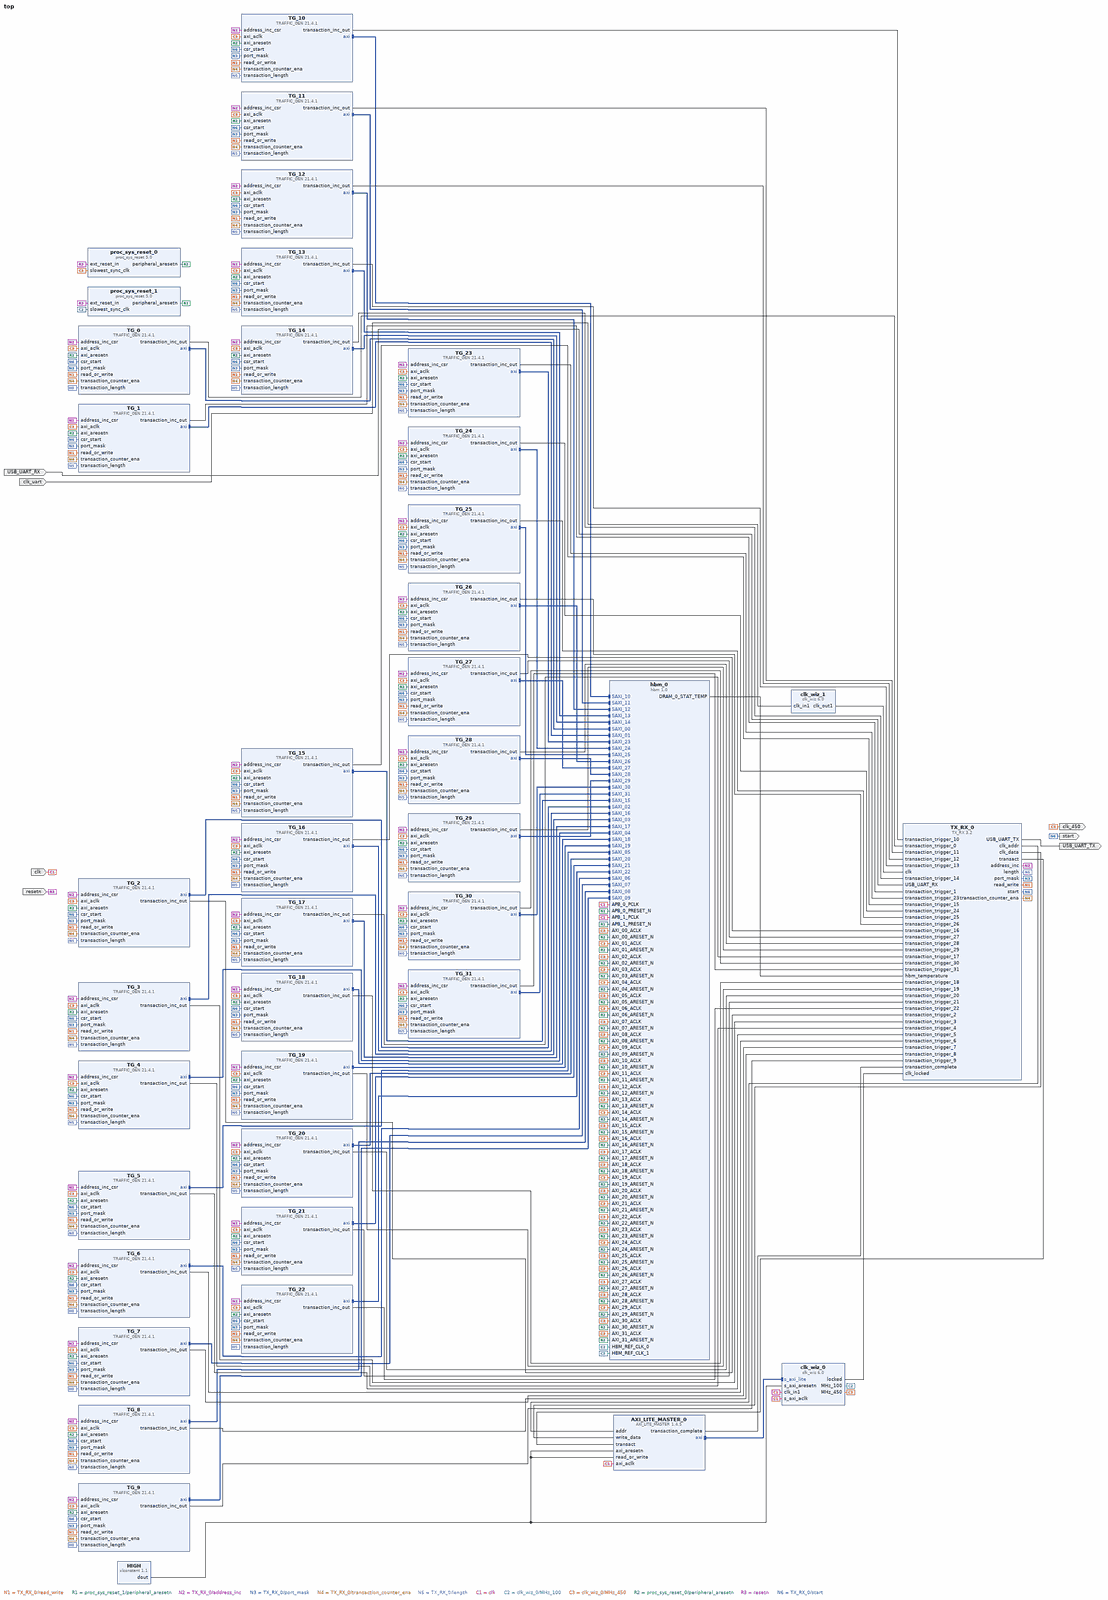
[diagram p0: block diagram of the top level, whole]
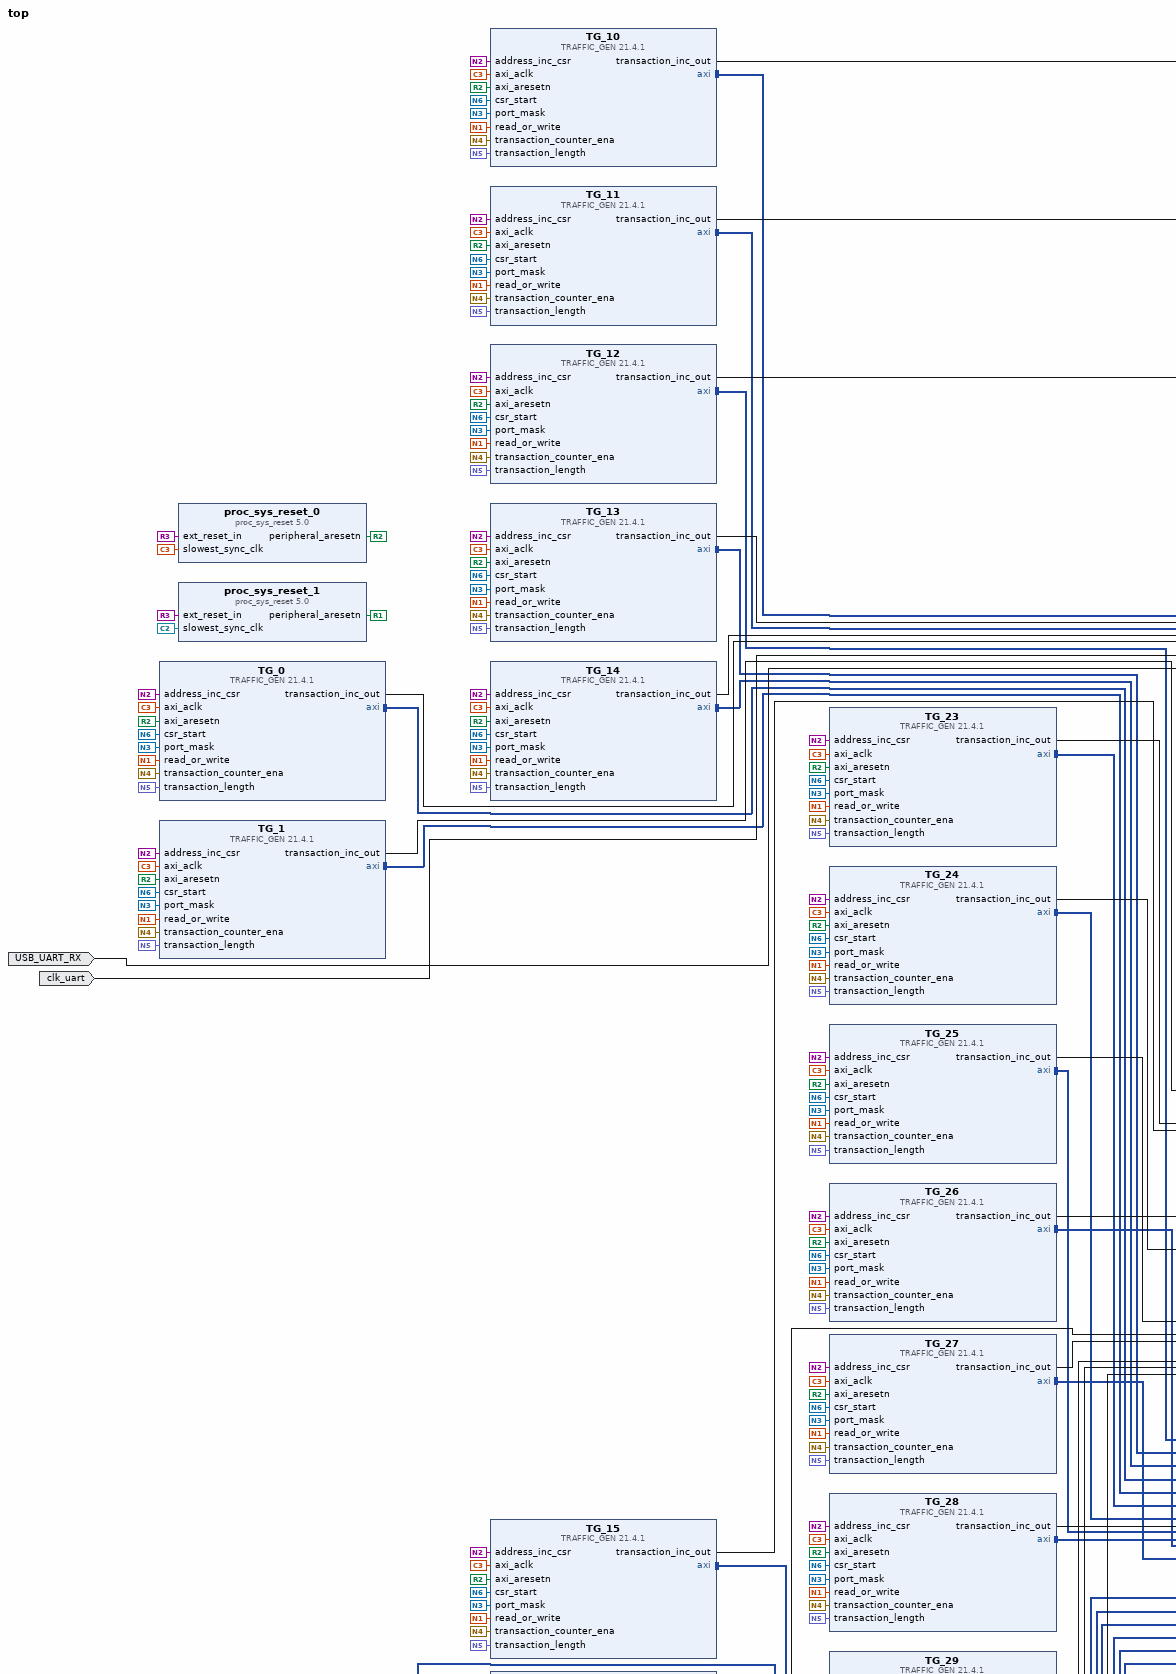
[diagram p1: block diagram of the top level, upper left part]
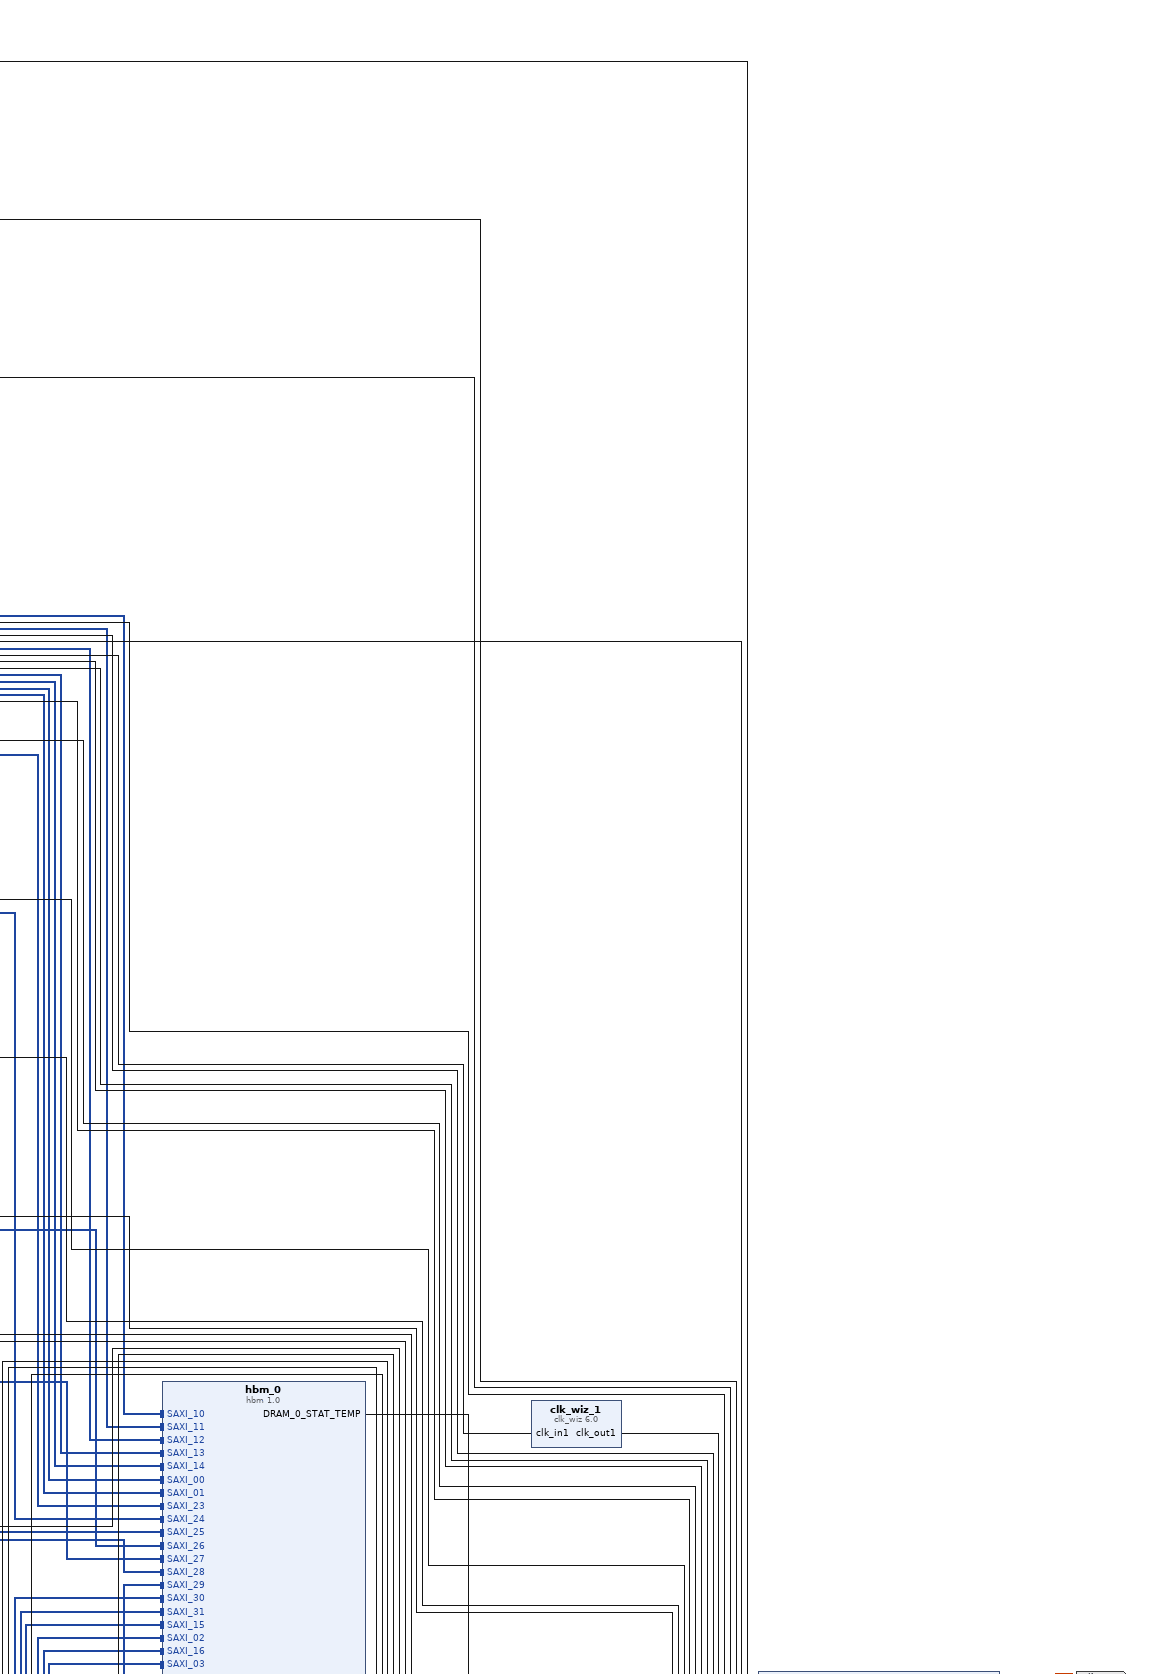
[diagram p2: block diagram of the top level, upper right part]
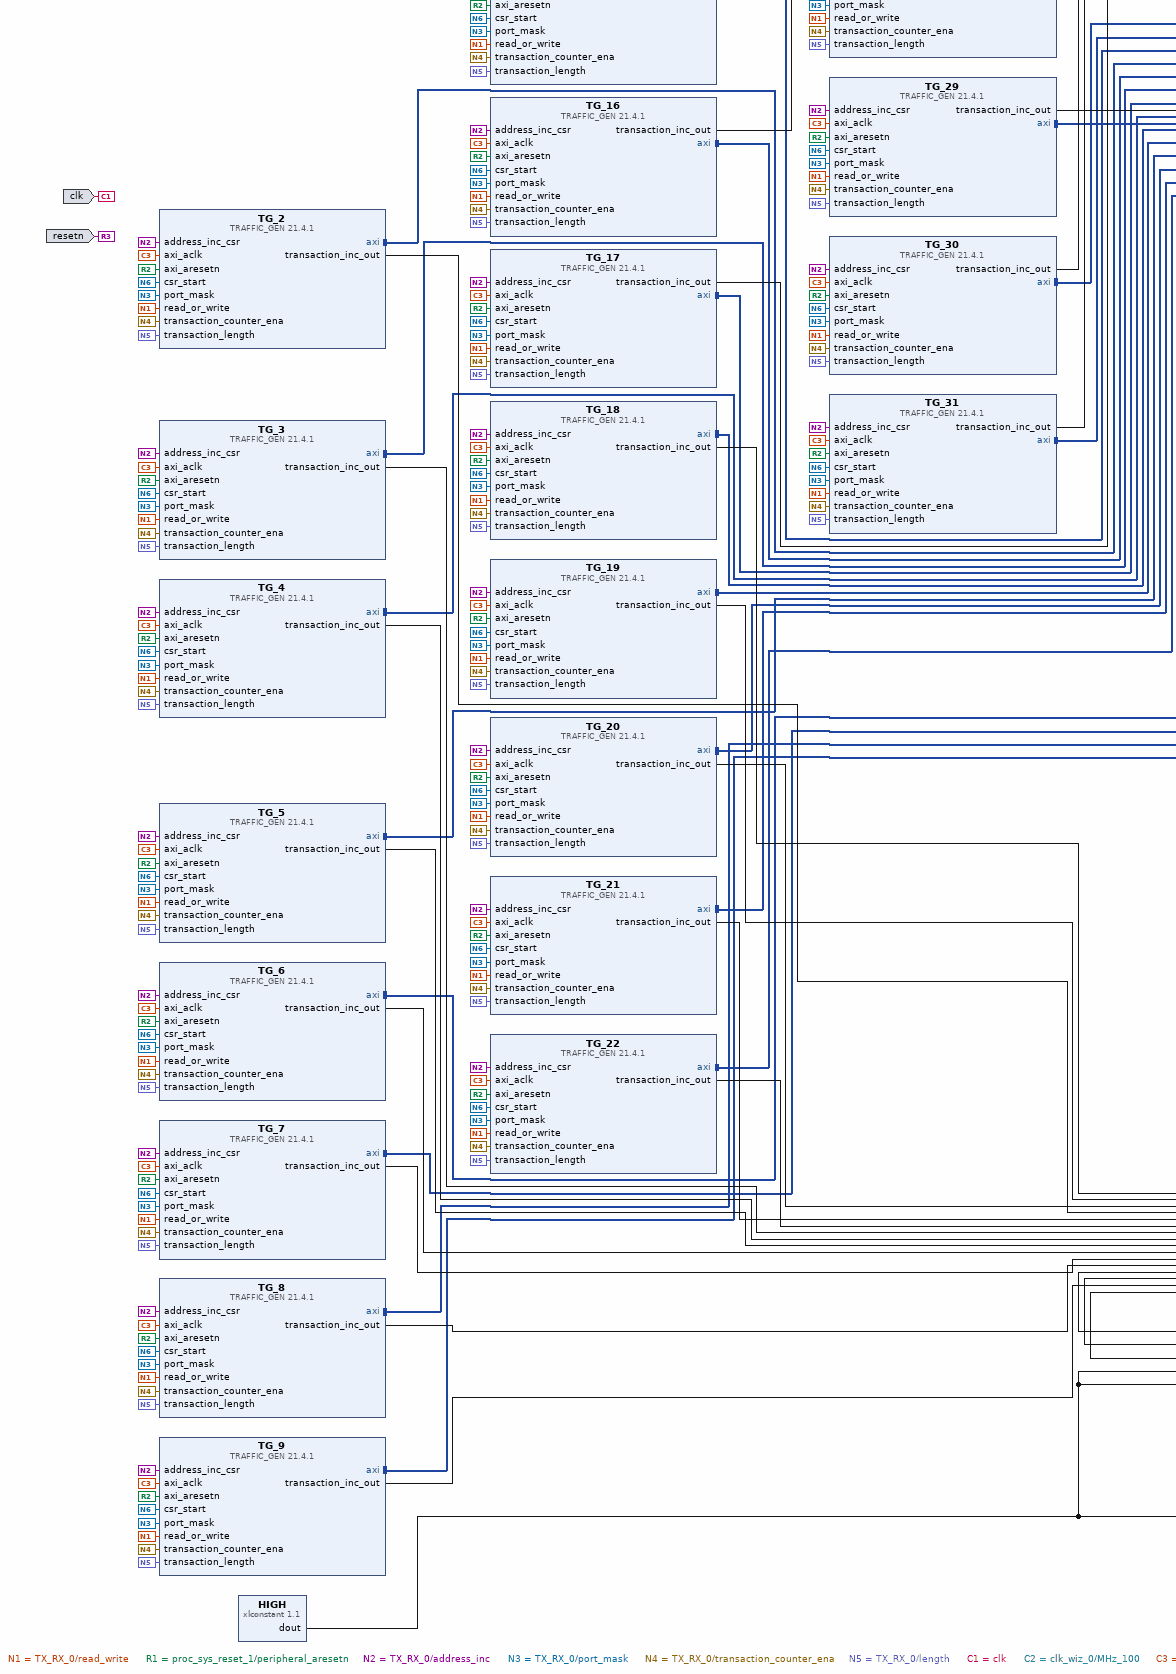
[diagram p3: block diagram of the top level, lower left part]
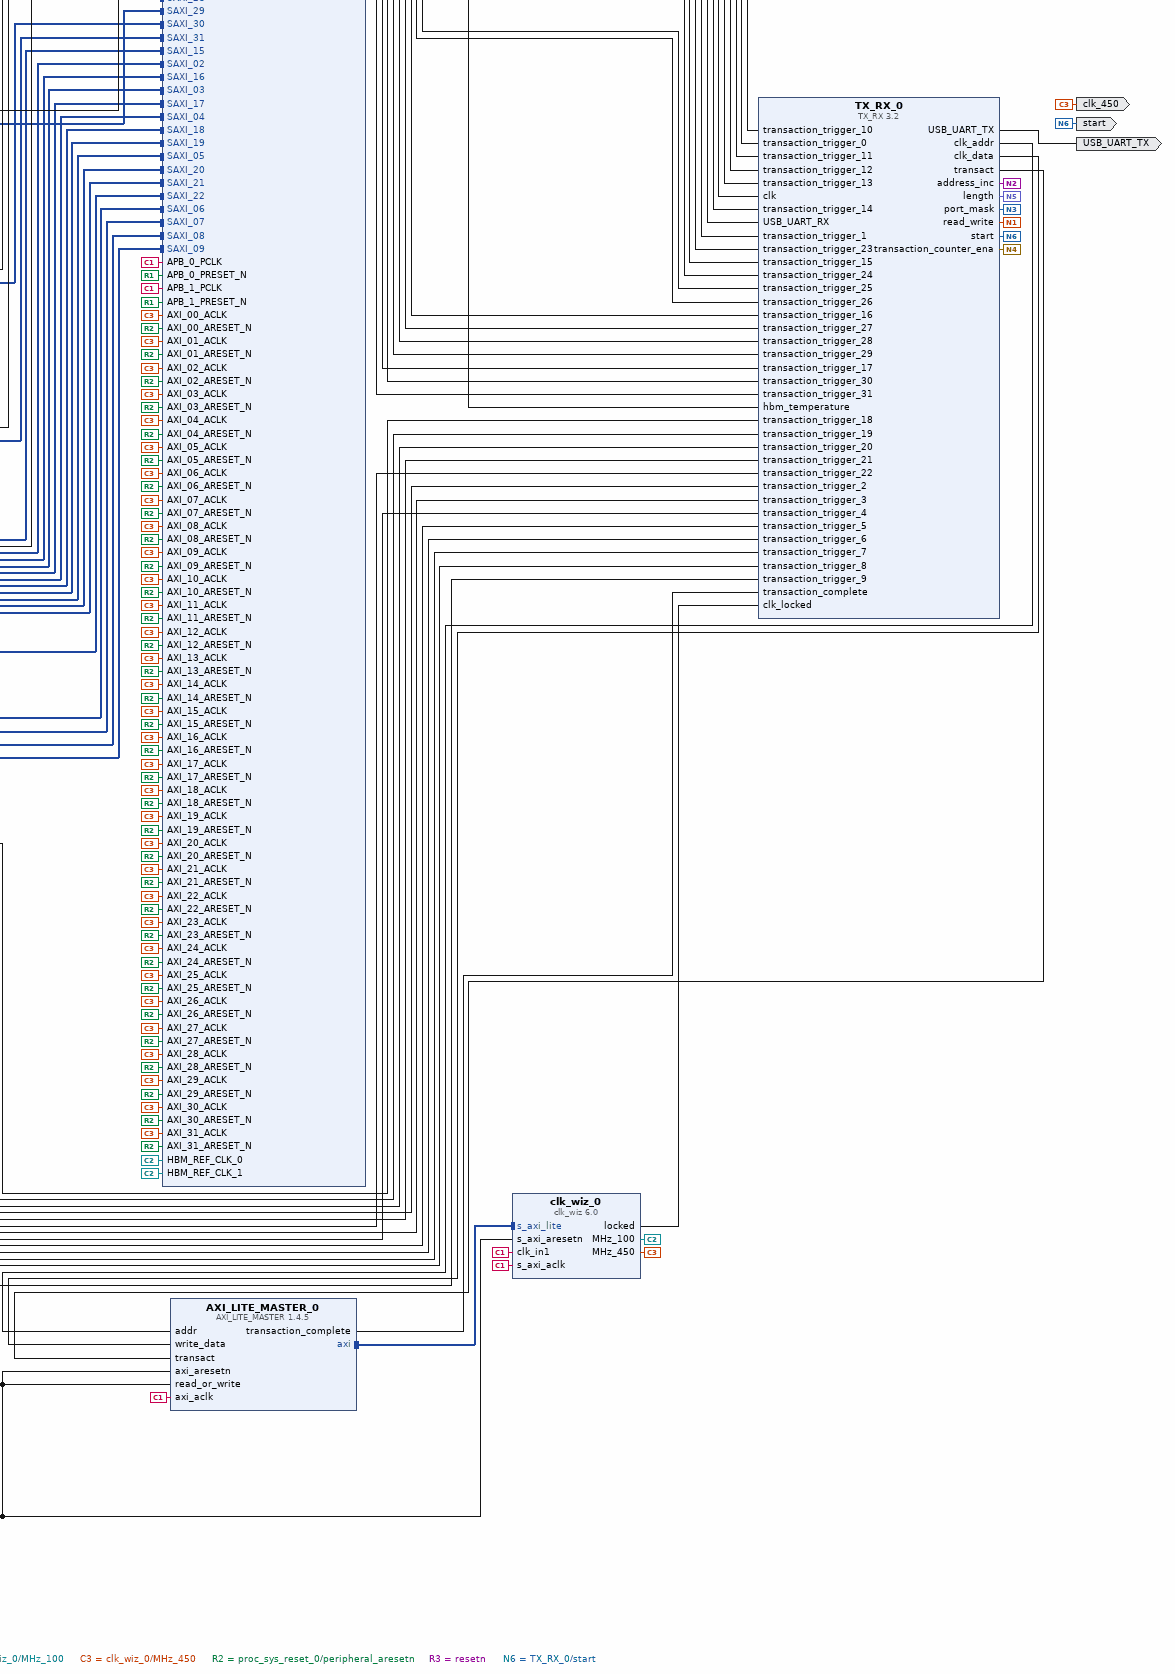
[diagram p4: block diagram of the top level, lower right part]
# Vivado block design top, xcu280-fsvh2892-2L-e, Vivado 2022.2
create_bd_design top

create_bd_port -dir I -type clk clk
set_property -dict {CONFIG.CLK_DOMAIN clk} [get_bd_ports clk]
create_bd_port -dir I -type rst resetn
set_property -dict {CONFIG.POLARITY ACTIVE_HIGH} [get_bd_ports resetn]
create_bd_port -dir I clk_uart
create_bd_port -dir O clk_450
create_bd_port -dir I USB_UART_RX
create_bd_port -dir O USB_UART_TX
create_bd_port -dir O start

create_bd_cell -type ip -vlnv xilinx.com:ip:hbm:1.0 hbm_0
set_property -dict [list \
  CONFIG.USER_APB_EN false \
  CONFIG.USER_APB_PCLK_0 100 \
  CONFIG.USER_APB_PCLK_1 100 \
  CONFIG.USER_AUTO_POPULATE yes \
  CONFIG.USER_DEBUG_EN FALSE \
  CONFIG.USER_HBM_DENSITY 8GB \
  CONFIG.USER_MC0_BG_INTERLEAVE_EN true \
  CONFIG.USER_MC0_CLOSE_PAGE_REORDER false \
  CONFIG.USER_MC0_EN_SBREF false \
  CONFIG.USER_MC0_LOOKAHEAD_ACT true \
  CONFIG.USER_MC0_LOOKAHEAD_PCH true \
  CONFIG.USER_MC0_MAINTAIN_COHERENCY true \
  CONFIG.USER_MC0_MANUAL_ADDR_MAP_SEL false \
  CONFIG.USER_MC0_POP_EN true \
  CONFIG.USER_MC0_REF_TEMP_COMP false \
  CONFIG.USER_MC0_REORDER_EN true \
  CONFIG.USER_MC0_TEMP_CTRL_SELF_REF_INTVL true \
  CONFIG.USER_MC0_TRAFFIC_OPTION User_Defined \
  CONFIG.USER_SWITCH_ENABLE_00 TRUE \
  CONFIG.USER_SWITCH_ENABLE_01 TRUE \
  CONFIG.USER_XSDB_INTF_EN TRUE \
] [get_bd_cells hbm_0]
create_bd_cell -type ip -vlnv xilinx.com:ip:clk_wiz:6.0 clk_wiz_0
set_property -dict [list \
  CONFIG.AXI_DRP true \
  CONFIG.CLKOUT1_DRIVES Buffer \
  CONFIG.CLKOUT1_JITTER 103.830 \
  CONFIG.CLKOUT1_PHASE_ERROR 105.461 \
  CONFIG.CLKOUT1_REQUESTED_OUT_FREQ 450 \
  CONFIG.CLKOUT2_DRIVES Buffer \
  CONFIG.CLKOUT2_JITTER 137.681 \
  CONFIG.CLKOUT2_PHASE_ERROR 105.461 \
  CONFIG.CLKOUT2_REQUESTED_OUT_FREQ 100 \
  CONFIG.CLKOUT2_USED true \
  CONFIG.CLKOUT3_DRIVES Buffer \
  CONFIG.CLKOUT3_JITTER 159.475 \
  CONFIG.CLKOUT3_PHASE_ERROR 105.461 \
  CONFIG.CLKOUT3_REQUESTED_OUT_FREQ 66.66667 \
  CONFIG.CLKOUT3_USED false \
  CONFIG.CLKOUT4_DRIVES Buffer \
  CONFIG.CLKOUT5_DRIVES Buffer \
  CONFIG.CLKOUT6_DRIVES Buffer \
  CONFIG.CLKOUT7_DRIVES Buffer \
  CONFIG.CLK_OUT1_PORT MHz_450 \
  CONFIG.CLK_OUT2_PORT MHz_100 \
  CONFIG.CLK_OUT3_PORT APB \
  CONFIG.ENABLE_CLOCK_MONITOR false \
  CONFIG.FEEDBACK_SOURCE FDBK_AUTO \
  CONFIG.INTERFACE_SELECTION Enable_AXI \
  CONFIG.MMCM_BANDWIDTH OPTIMIZED \
  CONFIG.MMCM_CLKFBOUT_MULT_F 9.000 \
  CONFIG.MMCM_CLKIN1_PERIOD 10.000 \
  CONFIG.MMCM_CLKIN2_PERIOD 10.000 \
  CONFIG.MMCM_CLKOUT0_DIVIDE_F 2.000 \
  CONFIG.MMCM_CLKOUT1_DIVIDE 9 \
  CONFIG.MMCM_CLKOUT2_DIVIDE 1 \
  CONFIG.MMCM_COMPENSATION AUTO \
  CONFIG.MMCM_DIVCLK_DIVIDE 1 \
  CONFIG.NUM_OUT_CLKS 2 \
  CONFIG.OPTIMIZE_CLOCKING_STRUCTURE_EN false \
  CONFIG.PHASE_DUTY_CONFIG false \
  CONFIG.PRIMITIVE MMCM \
  CONFIG.RESET_BOARD_INTERFACE resetn \
  CONFIG.RESET_PORT reset \
  CONFIG.RESET_TYPE ACTIVE_HIGH \
  CONFIG.USE_BOARD_FLOW true \
  CONFIG.USE_DYN_RECONFIG true \
  CONFIG.USE_LOCKED true \
  CONFIG.USE_RESET true \
] [get_bd_cells clk_wiz_0]
create_bd_cell -type ip -vlnv xilinx.com:ip:proc_sys_reset:5.0 proc_sys_reset_0
set_property -dict {CONFIG.RESET_BOARD_INTERFACE resetn CONFIG.USE_BOARD_FLOW true} [get_bd_cells proc_sys_reset_0]
create_bd_cell -type ip -vlnv xilinx.com:ip:proc_sys_reset:5.0 proc_sys_reset_1
set_property -dict {CONFIG.RESET_BOARD_INTERFACE resetn CONFIG.USE_BOARD_FLOW true} [get_bd_cells proc_sys_reset_1]
create_bd_cell -type ip -vlnv user.org:user:TRAFFIC_GEN:21.4.1 TG_0
create_bd_cell -type ip -vlnv user.org:user:TRAFFIC_GEN:21.4.1 TG_10
set_property -dict {CONFIG.traffic_gen_num 10} [get_bd_cells TG_10]
create_bd_cell -type ip -vlnv user.org:user:TRAFFIC_GEN:21.4.1 TG_11
set_property -dict {CONFIG.traffic_gen_num 11} [get_bd_cells TG_11]
create_bd_cell -type ip -vlnv user.org:user:TRAFFIC_GEN:21.4.1 TG_12
set_property -dict {CONFIG.traffic_gen_num 12} [get_bd_cells TG_12]
create_bd_cell -type ip -vlnv user.org:user:TRAFFIC_GEN:21.4.1 TG_13
set_property -dict {CONFIG.traffic_gen_num 13} [get_bd_cells TG_13]
create_bd_cell -type ip -vlnv user.org:user:TRAFFIC_GEN:21.4.1 TG_14
set_property -dict {CONFIG.traffic_gen_num 14} [get_bd_cells TG_14]
create_bd_cell -type ip -vlnv user.org:user:TRAFFIC_GEN:21.4.1 TG_15
set_property -dict {CONFIG.traffic_gen_num 15} [get_bd_cells TG_15]
create_bd_cell -type ip -vlnv user.org:user:TRAFFIC_GEN:21.4.1 TG_16
set_property -dict {CONFIG.traffic_gen_num 16} [get_bd_cells TG_16]
create_bd_cell -type ip -vlnv user.org:user:TRAFFIC_GEN:21.4.1 TG_17
set_property -dict {CONFIG.traffic_gen_num 17} [get_bd_cells TG_17]
create_bd_cell -type ip -vlnv user.org:user:TRAFFIC_GEN:21.4.1 TG_18
set_property -dict {CONFIG.traffic_gen_num 18} [get_bd_cells TG_18]
create_bd_cell -type ip -vlnv user.org:user:TRAFFIC_GEN:21.4.1 TG_19
set_property -dict {CONFIG.traffic_gen_num 19} [get_bd_cells TG_19]
create_bd_cell -type ip -vlnv user.org:user:TRAFFIC_GEN:21.4.1 TG_1
set_property -dict {CONFIG.traffic_gen_num 1} [get_bd_cells TG_1]
create_bd_cell -type ip -vlnv user.org:user:TRAFFIC_GEN:21.4.1 TG_20
set_property -dict {CONFIG.traffic_gen_num 20} [get_bd_cells TG_20]
create_bd_cell -type ip -vlnv user.org:user:TRAFFIC_GEN:21.4.1 TG_21
set_property -dict {CONFIG.traffic_gen_num 21} [get_bd_cells TG_21]
create_bd_cell -type ip -vlnv user.org:user:TRAFFIC_GEN:21.4.1 TG_22
set_property -dict {CONFIG.traffic_gen_num 22} [get_bd_cells TG_22]
create_bd_cell -type ip -vlnv user.org:user:TRAFFIC_GEN:21.4.1 TG_23
set_property -dict {CONFIG.traffic_gen_num 23} [get_bd_cells TG_23]
create_bd_cell -type ip -vlnv user.org:user:TRAFFIC_GEN:21.4.1 TG_24
set_property -dict {CONFIG.traffic_gen_num 24} [get_bd_cells TG_24]
create_bd_cell -type ip -vlnv user.org:user:TRAFFIC_GEN:21.4.1 TG_25
set_property -dict {CONFIG.traffic_gen_num 25} [get_bd_cells TG_25]
create_bd_cell -type ip -vlnv user.org:user:TRAFFIC_GEN:21.4.1 TG_26
set_property -dict {CONFIG.traffic_gen_num 26} [get_bd_cells TG_26]
create_bd_cell -type ip -vlnv user.org:user:TRAFFIC_GEN:21.4.1 TG_27
set_property -dict {CONFIG.traffic_gen_num 27} [get_bd_cells TG_27]
create_bd_cell -type ip -vlnv user.org:user:TRAFFIC_GEN:21.4.1 TG_28
set_property -dict {CONFIG.traffic_gen_num 28} [get_bd_cells TG_28]
create_bd_cell -type ip -vlnv user.org:user:TRAFFIC_GEN:21.4.1 TG_29
set_property -dict {CONFIG.traffic_gen_num 29} [get_bd_cells TG_29]
create_bd_cell -type ip -vlnv user.org:user:TRAFFIC_GEN:21.4.1 TG_2
set_property -dict {CONFIG.traffic_gen_num 2} [get_bd_cells TG_2]
create_bd_cell -type ip -vlnv user.org:user:TRAFFIC_GEN:21.4.1 TG_30
set_property -dict {CONFIG.traffic_gen_num 30} [get_bd_cells TG_30]
create_bd_cell -type ip -vlnv user.org:user:TRAFFIC_GEN:21.4.1 TG_31
set_property -dict {CONFIG.traffic_gen_num 31} [get_bd_cells TG_31]
create_bd_cell -type ip -vlnv user.org:user:TRAFFIC_GEN:21.4.1 TG_3
set_property -dict {CONFIG.traffic_gen_num 3} [get_bd_cells TG_3]
create_bd_cell -type ip -vlnv user.org:user:TRAFFIC_GEN:21.4.1 TG_4
set_property -dict {CONFIG.traffic_gen_num 4} [get_bd_cells TG_4]
create_bd_cell -type ip -vlnv user.org:user:TRAFFIC_GEN:21.4.1 TG_5
set_property -dict {CONFIG.traffic_gen_num 5} [get_bd_cells TG_5]
create_bd_cell -type ip -vlnv user.org:user:TRAFFIC_GEN:21.4.1 TG_6
set_property -dict {CONFIG.traffic_gen_num 6} [get_bd_cells TG_6]
create_bd_cell -type ip -vlnv user.org:user:TRAFFIC_GEN:21.4.1 TG_7
set_property -dict {CONFIG.traffic_gen_num 7} [get_bd_cells TG_7]
create_bd_cell -type ip -vlnv user.org:user:TRAFFIC_GEN:21.4.1 TG_8
set_property -dict {CONFIG.traffic_gen_num 8} [get_bd_cells TG_8]
create_bd_cell -type ip -vlnv user.org:user:TRAFFIC_GEN:21.4.1 TG_9
set_property -dict {CONFIG.traffic_gen_num 9} [get_bd_cells TG_9]
create_bd_cell -type ip -vlnv xilinx.com:ip:xlconstant:1.1 HIGH
create_bd_cell -type ip -vlnv user.org:user:AXI_LITE_MASTER:1.4.5 AXI_LITE_MASTER_0
create_bd_cell -type ip -vlnv xilinx.com:ip:clk_wiz:6.0 clk_wiz_1
set_property -dict {CONFIG.USE_LOCKED false CONFIG.USE_RESET false} [get_bd_cells clk_wiz_1]
create_bd_cell -type ip -vlnv user.org:user:TX_RX:3.2 TX_RX_0

# ---- connections ----

connect_bd_intf_net [get_bd_intf_pins AXI_LITE_MASTER_0/axi] [get_bd_intf_pins clk_wiz_0/s_axi_lite]
connect_bd_intf_net -intf_net BIST_0_axi [get_bd_intf_pins TG_0/axi] [get_bd_intf_pins hbm_0/SAXI_00]
connect_bd_intf_net -intf_net BIST_10_axi [get_bd_intf_pins TG_10/axi] [get_bd_intf_pins hbm_0/SAXI_10]
connect_bd_intf_net -intf_net BIST_11_axi [get_bd_intf_pins TG_11/axi] [get_bd_intf_pins hbm_0/SAXI_11]
connect_bd_intf_net -intf_net BIST_12_axi [get_bd_intf_pins TG_12/axi] [get_bd_intf_pins hbm_0/SAXI_12]
connect_bd_intf_net -intf_net BIST_13_axi [get_bd_intf_pins TG_13/axi] [get_bd_intf_pins hbm_0/SAXI_13]
connect_bd_intf_net -intf_net BIST_14_axi [get_bd_intf_pins TG_14/axi] [get_bd_intf_pins hbm_0/SAXI_14]
connect_bd_intf_net -intf_net BIST_15_axi [get_bd_intf_pins TG_15/axi] [get_bd_intf_pins hbm_0/SAXI_15]
connect_bd_intf_net -intf_net BIST_16_axi [get_bd_intf_pins hbm_0/SAXI_16] [get_bd_intf_pins TG_16/axi]
connect_bd_intf_net -intf_net BIST_17_axi [get_bd_intf_pins hbm_0/SAXI_17] [get_bd_intf_pins TG_17/axi]
connect_bd_intf_net -intf_net BIST_18_axi [get_bd_intf_pins hbm_0/SAXI_18] [get_bd_intf_pins TG_18/axi]
connect_bd_intf_net -intf_net BIST_19_axi [get_bd_intf_pins hbm_0/SAXI_19] [get_bd_intf_pins TG_19/axi]
connect_bd_intf_net -intf_net BIST_1_axi [get_bd_intf_pins TG_1/axi] [get_bd_intf_pins hbm_0/SAXI_01]
connect_bd_intf_net -intf_net BIST_20_axi [get_bd_intf_pins hbm_0/SAXI_20] [get_bd_intf_pins TG_20/axi]
connect_bd_intf_net -intf_net BIST_21_axi [get_bd_intf_pins hbm_0/SAXI_21] [get_bd_intf_pins TG_21/axi]
connect_bd_intf_net -intf_net BIST_22_axi [get_bd_intf_pins hbm_0/SAXI_22] [get_bd_intf_pins TG_22/axi]
connect_bd_intf_net -intf_net BIST_23_axi [get_bd_intf_pins hbm_0/SAXI_23] [get_bd_intf_pins TG_23/axi]
connect_bd_intf_net -intf_net BIST_24_axi [get_bd_intf_pins hbm_0/SAXI_24] [get_bd_intf_pins TG_24/axi]
connect_bd_intf_net -intf_net BIST_25_axi [get_bd_intf_pins hbm_0/SAXI_25] [get_bd_intf_pins TG_25/axi]
connect_bd_intf_net -intf_net BIST_26_axi [get_bd_intf_pins hbm_0/SAXI_26] [get_bd_intf_pins TG_26/axi]
connect_bd_intf_net -intf_net BIST_27_axi [get_bd_intf_pins hbm_0/SAXI_27] [get_bd_intf_pins TG_27/axi]
connect_bd_intf_net -intf_net BIST_28_axi [get_bd_intf_pins hbm_0/SAXI_28] [get_bd_intf_pins TG_28/axi]
connect_bd_intf_net -intf_net BIST_29_axi [get_bd_intf_pins hbm_0/SAXI_29] [get_bd_intf_pins TG_29/axi]
connect_bd_intf_net -intf_net BIST_2_axi [get_bd_intf_pins TG_2/axi] [get_bd_intf_pins hbm_0/SAXI_02]
connect_bd_intf_net -intf_net BIST_30_axi [get_bd_intf_pins hbm_0/SAXI_30] [get_bd_intf_pins TG_30/axi]
connect_bd_intf_net -intf_net BIST_31_axi [get_bd_intf_pins hbm_0/SAXI_31] [get_bd_intf_pins TG_31/axi]
connect_bd_intf_net -intf_net BIST_3_axi [get_bd_intf_pins TG_3/axi] [get_bd_intf_pins hbm_0/SAXI_03]
connect_bd_intf_net -intf_net BIST_4_axi [get_bd_intf_pins TG_4/axi] [get_bd_intf_pins hbm_0/SAXI_04]
connect_bd_intf_net -intf_net BIST_5_axi [get_bd_intf_pins TG_5/axi] [get_bd_intf_pins hbm_0/SAXI_05]
connect_bd_intf_net -intf_net BIST_6_axi [get_bd_intf_pins TG_6/axi] [get_bd_intf_pins hbm_0/SAXI_06]
connect_bd_intf_net -intf_net BIST_7_axi [get_bd_intf_pins TG_7/axi] [get_bd_intf_pins hbm_0/SAXI_07]
connect_bd_intf_net -intf_net BIST_8_axi [get_bd_intf_pins TG_8/axi] [get_bd_intf_pins hbm_0/SAXI_08]
connect_bd_intf_net -intf_net BIST_9_axi [get_bd_intf_pins TG_9/axi] [get_bd_intf_pins hbm_0/SAXI_09]
connect_bd_net [get_bd_pins AXI_LITE_MASTER_0/transaction_complete] [get_bd_pins TX_RX_0/transaction_complete]
connect_bd_net [get_bd_pins TX_RX_0/read_write] \
  [get_bd_pins TG_0/read_or_write] [get_bd_pins TG_10/read_or_write] [get_bd_pins TG_11/read_or_write] \
  [get_bd_pins TG_12/read_or_write] [get_bd_pins TG_13/read_or_write] [get_bd_pins TG_14/read_or_write] \
  [get_bd_pins TG_15/read_or_write] [get_bd_pins TG_16/read_or_write] [get_bd_pins TG_17/read_or_write] \
  [get_bd_pins TG_18/read_or_write] [get_bd_pins TG_19/read_or_write] [get_bd_pins TG_1/read_or_write] \
  [get_bd_pins TG_20/read_or_write] [get_bd_pins TG_21/read_or_write] [get_bd_pins TG_22/read_or_write] \
  [get_bd_pins TG_23/read_or_write] [get_bd_pins TG_24/read_or_write] [get_bd_pins TG_25/read_or_write] \
  [get_bd_pins TG_26/read_or_write] [get_bd_pins TG_27/read_or_write] [get_bd_pins TG_28/read_or_write] \
  [get_bd_pins TG_29/read_or_write] [get_bd_pins TG_2/read_or_write] [get_bd_pins TG_30/read_or_write] \
  [get_bd_pins TG_31/read_or_write] [get_bd_pins TG_3/read_or_write] [get_bd_pins TG_4/read_or_write] \
  [get_bd_pins TG_5/read_or_write] [get_bd_pins TG_6/read_or_write] [get_bd_pins TG_7/read_or_write] \
  [get_bd_pins TG_8/read_or_write] [get_bd_pins TG_9/read_or_write]
connect_bd_net [get_bd_pins proc_sys_reset_1/peripheral_aresetn] [get_bd_pins hbm_0/APB_1_PRESET_N] [get_bd_pins hbm_0/APB_0_PRESET_N]
connect_bd_net [get_bd_pins TX_RX_0/address_inc] \
  [get_bd_pins TG_0/address_inc_csr] [get_bd_pins TG_10/address_inc_csr] [get_bd_pins TG_11/address_inc_csr] \
  [get_bd_pins TG_12/address_inc_csr] [get_bd_pins TG_13/address_inc_csr] [get_bd_pins TG_14/address_inc_csr] \
  [get_bd_pins TG_15/address_inc_csr] [get_bd_pins TG_16/address_inc_csr] [get_bd_pins TG_17/address_inc_csr] \
  [get_bd_pins TG_18/address_inc_csr] [get_bd_pins TG_19/address_inc_csr] [get_bd_pins TG_1/address_inc_csr] \
  [get_bd_pins TG_20/address_inc_csr] [get_bd_pins TG_21/address_inc_csr] [get_bd_pins TG_22/address_inc_csr] \
  [get_bd_pins TG_23/address_inc_csr] [get_bd_pins TG_24/address_inc_csr] [get_bd_pins TG_25/address_inc_csr] \
  [get_bd_pins TG_26/address_inc_csr] [get_bd_pins TG_27/address_inc_csr] [get_bd_pins TG_28/address_inc_csr] \
  [get_bd_pins TG_29/address_inc_csr] [get_bd_pins TG_2/address_inc_csr] [get_bd_pins TG_30/address_inc_csr] \
  [get_bd_pins TG_31/address_inc_csr] [get_bd_pins TG_3/address_inc_csr] [get_bd_pins TG_4/address_inc_csr] \
  [get_bd_pins TG_5/address_inc_csr] [get_bd_pins TG_6/address_inc_csr] [get_bd_pins TG_7/address_inc_csr] \
  [get_bd_pins TG_8/address_inc_csr] [get_bd_pins TG_9/address_inc_csr]
connect_bd_net [get_bd_pins TX_RX_0/port_mask] \
  [get_bd_pins TG_0/port_mask] [get_bd_pins TG_10/port_mask] [get_bd_pins TG_11/port_mask] [get_bd_pins TG_12/port_mask] \
  [get_bd_pins TG_13/port_mask] [get_bd_pins TG_14/port_mask] [get_bd_pins TG_15/port_mask] [get_bd_pins TG_16/port_mask] \
  [get_bd_pins TG_17/port_mask] [get_bd_pins TG_18/port_mask] [get_bd_pins TG_19/port_mask] [get_bd_pins TG_1/port_mask] \
  [get_bd_pins TG_20/port_mask] [get_bd_pins TG_21/port_mask] [get_bd_pins TG_22/port_mask] [get_bd_pins TG_23/port_mask] \
  [get_bd_pins TG_24/port_mask] [get_bd_pins TG_25/port_mask] [get_bd_pins TG_26/port_mask] [get_bd_pins TG_27/port_mask] \
  [get_bd_pins TG_28/port_mask] [get_bd_pins TG_29/port_mask] [get_bd_pins TG_2/port_mask] [get_bd_pins TG_30/port_mask] \
  [get_bd_pins TG_31/port_mask] [get_bd_pins TG_3/port_mask] [get_bd_pins TG_4/port_mask] [get_bd_pins TG_5/port_mask] \
  [get_bd_pins TG_6/port_mask] [get_bd_pins TG_7/port_mask] [get_bd_pins TG_8/port_mask] [get_bd_pins TG_9/port_mask]
connect_bd_net [get_bd_pins TX_RX_0/transaction_counter_ena] \
  [get_bd_pins TG_0/transaction_counter_ena] [get_bd_pins TG_10/transaction_counter_ena] \
  [get_bd_pins TG_11/transaction_counter_ena] [get_bd_pins TG_12/transaction_counter_ena] \
  [get_bd_pins TG_13/transaction_counter_ena] [get_bd_pins TG_14/transaction_counter_ena] \
  [get_bd_pins TG_15/transaction_counter_ena] [get_bd_pins TG_16/transaction_counter_ena] \
  [get_bd_pins TG_17/transaction_counter_ena] [get_bd_pins TG_18/transaction_counter_ena] \
  [get_bd_pins TG_19/transaction_counter_ena] [get_bd_pins TG_1/transaction_counter_ena] \
  [get_bd_pins TG_20/transaction_counter_ena] [get_bd_pins TG_21/transaction_counter_ena] \
  [get_bd_pins TG_22/transaction_counter_ena] [get_bd_pins TG_23/transaction_counter_ena] \
  [get_bd_pins TG_24/transaction_counter_ena] [get_bd_pins TG_25/transaction_counter_ena] \
  [get_bd_pins TG_26/transaction_counter_ena] [get_bd_pins TG_27/transaction_counter_ena] \
  [get_bd_pins TG_28/transaction_counter_ena] [get_bd_pins TG_29/transaction_counter_ena] \
  [get_bd_pins TG_2/transaction_counter_ena] [get_bd_pins TG_30/transaction_counter_ena] \
  [get_bd_pins TG_31/transaction_counter_ena] [get_bd_pins TG_3/transaction_counter_ena] \
  [get_bd_pins TG_4/transaction_counter_ena] [get_bd_pins TG_5/transaction_counter_ena] \
  [get_bd_pins TG_6/transaction_counter_ena] [get_bd_pins TG_7/transaction_counter_ena] \
  [get_bd_pins TG_8/transaction_counter_ena] [get_bd_pins TG_9/transaction_counter_ena]
connect_bd_net [get_bd_pins TG_0/transaction_inc_out] [get_bd_pins TX_RX_0/transaction_trigger_0]
connect_bd_net [get_bd_pins TG_10/transaction_inc_out] [get_bd_pins TX_RX_0/transaction_trigger_10]
connect_bd_net [get_bd_pins TG_11/transaction_inc_out] [get_bd_pins TX_RX_0/transaction_trigger_11]
connect_bd_net [get_bd_pins TG_12/transaction_inc_out] [get_bd_pins TX_RX_0/transaction_trigger_12]
connect_bd_net [get_bd_pins TG_13/transaction_inc_out] [get_bd_pins TX_RX_0/transaction_trigger_13]
connect_bd_net [get_bd_pins TG_14/transaction_inc_out] [get_bd_pins TX_RX_0/transaction_trigger_14]
connect_bd_net [get_bd_pins TG_15/transaction_inc_out] [get_bd_pins TX_RX_0/transaction_trigger_15]
connect_bd_net [get_bd_pins TG_16/transaction_inc_out] [get_bd_pins TX_RX_0/transaction_trigger_16]
connect_bd_net [get_bd_pins TG_17/transaction_inc_out] [get_bd_pins TX_RX_0/transaction_trigger_17]
connect_bd_net [get_bd_pins TG_18/transaction_inc_out] [get_bd_pins TX_RX_0/transaction_trigger_18]
connect_bd_net [get_bd_pins TG_19/transaction_inc_out] [get_bd_pins TX_RX_0/transaction_trigger_19]
connect_bd_net [get_bd_pins TG_1/transaction_inc_out] [get_bd_pins TX_RX_0/transaction_trigger_1]
connect_bd_net [get_bd_pins TG_20/transaction_inc_out] [get_bd_pins TX_RX_0/transaction_trigger_20]
connect_bd_net [get_bd_pins TG_21/transaction_inc_out] [get_bd_pins TX_RX_0/transaction_trigger_21]
connect_bd_net [get_bd_pins TG_22/transaction_inc_out] [get_bd_pins TX_RX_0/transaction_trigger_22]
connect_bd_net [get_bd_pins TG_23/transaction_inc_out] [get_bd_pins TX_RX_0/transaction_trigger_23]
connect_bd_net [get_bd_pins TG_24/transaction_inc_out] [get_bd_pins TX_RX_0/transaction_trigger_24]
connect_bd_net [get_bd_pins TG_25/transaction_inc_out] [get_bd_pins TX_RX_0/transaction_trigger_25]
connect_bd_net [get_bd_pins TG_26/transaction_inc_out] [get_bd_pins TX_RX_0/transaction_trigger_26]
connect_bd_net [get_bd_pins TG_27/transaction_inc_out] [get_bd_pins TX_RX_0/transaction_trigger_27]
connect_bd_net [get_bd_pins TG_28/transaction_inc_out] [get_bd_pins TX_RX_0/transaction_trigger_28]
connect_bd_net [get_bd_pins TG_29/transaction_inc_out] [get_bd_pins TX_RX_0/transaction_trigger_29]
connect_bd_net [get_bd_pins TG_2/transaction_inc_out] [get_bd_pins TX_RX_0/transaction_trigger_2]
connect_bd_net [get_bd_pins TG_30/transaction_inc_out] [get_bd_pins TX_RX_0/transaction_trigger_30]
connect_bd_net [get_bd_pins TG_31/transaction_inc_out] [get_bd_pins TX_RX_0/transaction_trigger_31]
connect_bd_net [get_bd_pins TG_3/transaction_inc_out] [get_bd_pins TX_RX_0/transaction_trigger_3]
connect_bd_net [get_bd_pins TG_4/transaction_inc_out] [get_bd_pins TX_RX_0/transaction_trigger_4]
connect_bd_net [get_bd_pins TG_5/transaction_inc_out] [get_bd_pins TX_RX_0/transaction_trigger_5]
connect_bd_net [get_bd_pins TG_6/transaction_inc_out] [get_bd_pins TX_RX_0/transaction_trigger_6]
connect_bd_net [get_bd_pins TG_7/transaction_inc_out] [get_bd_pins TX_RX_0/transaction_trigger_7]
connect_bd_net [get_bd_pins TG_8/transaction_inc_out] [get_bd_pins TX_RX_0/transaction_trigger_8]
connect_bd_net [get_bd_pins TG_9/transaction_inc_out] [get_bd_pins TX_RX_0/transaction_trigger_9]
connect_bd_net [get_bd_pins TX_RX_0/USB_UART_TX] [get_bd_ports USB_UART_TX]
connect_bd_net [get_bd_pins TX_RX_0/clk_addr] [get_bd_pins AXI_LITE_MASTER_0/addr]
connect_bd_net [get_bd_pins TX_RX_0/clk_data] [get_bd_pins AXI_LITE_MASTER_0/write_data]
connect_bd_net [get_bd_pins TX_RX_0/length] \
  [get_bd_pins TG_0/transaction_length] [get_bd_pins TG_10/transaction_length] [get_bd_pins TG_11/transaction_length] \
  [get_bd_pins TG_12/transaction_length] [get_bd_pins TG_13/transaction_length] [get_bd_pins TG_14/transaction_length] \
  [get_bd_pins TG_15/transaction_length] [get_bd_pins TG_16/transaction_length] [get_bd_pins TG_17/transaction_length] \
  [get_bd_pins TG_18/transaction_length] [get_bd_pins TG_19/transaction_length] [get_bd_pins TG_1/transaction_length] \
  [get_bd_pins TG_20/transaction_length] [get_bd_pins TG_21/transaction_length] [get_bd_pins TG_22/transaction_length] \
  [get_bd_pins TG_23/transaction_length] [get_bd_pins TG_24/transaction_length] [get_bd_pins TG_25/transaction_length] \
  [get_bd_pins TG_26/transaction_length] [get_bd_pins TG_27/transaction_length] [get_bd_pins TG_28/transaction_length] \
  [get_bd_pins TG_29/transaction_length] [get_bd_pins TG_2/transaction_length] [get_bd_pins TG_30/transaction_length] \
  [get_bd_pins TG_31/transaction_length] [get_bd_pins TG_3/transaction_length] [get_bd_pins TG_4/transaction_length] \
  [get_bd_pins TG_5/transaction_length] [get_bd_pins TG_6/transaction_length] [get_bd_pins TG_7/transaction_length] \
  [get_bd_pins TG_8/transaction_length] [get_bd_pins TG_9/transaction_length]
connect_bd_net [get_bd_pins TX_RX_0/transact] [get_bd_pins AXI_LITE_MASTER_0/transact]
connect_bd_net -net USB_UART_RX_0_1 [get_bd_ports USB_UART_RX] [get_bd_pins TX_RX_0/USB_UART_RX]
connect_bd_net -net clk_in1_0_1 [get_bd_ports clk] \
  [get_bd_pins clk_wiz_0/clk_in1] [get_bd_pins clk_wiz_0/s_axi_aclk] [get_bd_pins AXI_LITE_MASTER_0/axi_aclk] \
  [get_bd_pins hbm_0/APB_1_PCLK] [get_bd_pins hbm_0/APB_0_PCLK]
connect_bd_net [get_bd_ports clk_uart] [get_bd_pins clk_wiz_1/clk_in1]
connect_bd_net [get_bd_pins clk_wiz_0/MHz_100] \
  [get_bd_pins hbm_0/HBM_REF_CLK_0] [get_bd_pins proc_sys_reset_1/slowest_sync_clk] [get_bd_pins hbm_0/HBM_REF_CLK_1]
connect_bd_net [get_bd_pins clk_wiz_0/MHz_450] \
  [get_bd_pins hbm_0/AXI_00_ACLK] [get_bd_pins hbm_0/AXI_01_ACLK] [get_bd_pins hbm_0/AXI_02_ACLK] \
  [get_bd_pins hbm_0/AXI_03_ACLK] [get_bd_pins hbm_0/AXI_04_ACLK] [get_bd_pins hbm_0/AXI_05_ACLK] \
  [get_bd_pins hbm_0/AXI_06_ACLK] [get_bd_pins hbm_0/AXI_07_ACLK] [get_bd_pins hbm_0/AXI_08_ACLK] \
  [get_bd_pins hbm_0/AXI_09_ACLK] [get_bd_pins hbm_0/AXI_10_ACLK] [get_bd_pins hbm_0/AXI_11_ACLK] \
  [get_bd_pins hbm_0/AXI_12_ACLK] [get_bd_pins hbm_0/AXI_13_ACLK] [get_bd_pins hbm_0/AXI_14_ACLK] \
  [get_bd_pins hbm_0/AXI_15_ACLK] [get_bd_pins hbm_0/AXI_16_ACLK] [get_bd_pins hbm_0/AXI_17_ACLK] \
  [get_bd_pins hbm_0/AXI_18_ACLK] [get_bd_pins hbm_0/AXI_19_ACLK] [get_bd_pins hbm_0/AXI_20_ACLK] \
  [get_bd_pins hbm_0/AXI_21_ACLK] [get_bd_pins hbm_0/AXI_22_ACLK] [get_bd_pins hbm_0/AXI_23_ACLK] \
  [get_bd_pins hbm_0/AXI_24_ACLK] [get_bd_pins hbm_0/AXI_25_ACLK] [get_bd_pins hbm_0/AXI_26_ACLK] \
  [get_bd_pins hbm_0/AXI_27_ACLK] [get_bd_pins hbm_0/AXI_28_ACLK] [get_bd_pins hbm_0/AXI_29_ACLK] \
  [get_bd_pins hbm_0/AXI_30_ACLK] [get_bd_pins hbm_0/AXI_31_ACLK] [get_bd_pins proc_sys_reset_0/slowest_sync_clk] \
  [get_bd_ports clk_450] [get_bd_pins TG_0/axi_aclk] [get_bd_pins TG_10/axi_aclk] [get_bd_pins TG_11/axi_aclk] \
  [get_bd_pins TG_12/axi_aclk] [get_bd_pins TG_13/axi_aclk] [get_bd_pins TG_14/axi_aclk] [get_bd_pins TG_15/axi_aclk] \
  [get_bd_pins TG_16/axi_aclk] [get_bd_pins TG_17/axi_aclk] [get_bd_pins TG_18/axi_aclk] [get_bd_pins TG_19/axi_aclk] \
  [get_bd_pins TG_1/axi_aclk] [get_bd_pins TG_20/axi_aclk] [get_bd_pins TG_21/axi_aclk] [get_bd_pins TG_22/axi_aclk] \
  [get_bd_pins TG_23/axi_aclk] [get_bd_pins TG_24/axi_aclk] [get_bd_pins TG_25/axi_aclk] [get_bd_pins TG_26/axi_aclk] \
  [get_bd_pins TG_27/axi_aclk] [get_bd_pins TG_28/axi_aclk] [get_bd_pins TG_29/axi_aclk] [get_bd_pins TG_2/axi_aclk] \
  [get_bd_pins TG_30/axi_aclk] [get_bd_pins TG_31/axi_aclk] [get_bd_pins TG_3/axi_aclk] [get_bd_pins TG_4/axi_aclk] \
  [get_bd_pins TG_5/axi_aclk] [get_bd_pins TG_6/axi_aclk] [get_bd_pins TG_7/axi_aclk] [get_bd_pins TG_8/axi_aclk] \
  [get_bd_pins TG_9/axi_aclk]
connect_bd_net [get_bd_pins clk_wiz_0/locked] [get_bd_pins TX_RX_0/clk_locked]
connect_bd_net [get_bd_pins clk_wiz_1/clk_out1] [get_bd_pins TX_RX_0/clk]
connect_bd_net [get_bd_pins hbm_0/DRAM_0_STAT_TEMP] [get_bd_pins TX_RX_0/hbm_temperature]
connect_bd_net -net resetn_1 [get_bd_pins proc_sys_reset_0/peripheral_aresetn] \
  [get_bd_pins hbm_0/AXI_00_ARESET_N] [get_bd_pins hbm_0/AXI_01_ARESET_N] [get_bd_pins hbm_0/AXI_02_ARESET_N] \
  [get_bd_pins hbm_0/AXI_03_ARESET_N] [get_bd_pins hbm_0/AXI_04_ARESET_N] [get_bd_pins hbm_0/AXI_05_ARESET_N] \
  [get_bd_pins hbm_0/AXI_06_ARESET_N] [get_bd_pins hbm_0/AXI_07_ARESET_N] [get_bd_pins hbm_0/AXI_08_ARESET_N] \
  [get_bd_pins hbm_0/AXI_09_ARESET_N] [get_bd_pins hbm_0/AXI_10_ARESET_N] [get_bd_pins hbm_0/AXI_11_ARESET_N] \
  [get_bd_pins hbm_0/AXI_12_ARESET_N] [get_bd_pins hbm_0/AXI_13_ARESET_N] [get_bd_pins hbm_0/AXI_14_ARESET_N] \
  [get_bd_pins hbm_0/AXI_15_ARESET_N] [get_bd_pins hbm_0/AXI_31_ARESET_N] [get_bd_pins hbm_0/AXI_30_ARESET_N] \
  [get_bd_pins hbm_0/AXI_29_ARESET_N] [get_bd_pins hbm_0/AXI_28_ARESET_N] [get_bd_pins hbm_0/AXI_27_ARESET_N] \
  [get_bd_pins hbm_0/AXI_26_ARESET_N] [get_bd_pins hbm_0/AXI_25_ARESET_N] [get_bd_pins hbm_0/AXI_24_ARESET_N] \
  [get_bd_pins hbm_0/AXI_23_ARESET_N] [get_bd_pins hbm_0/AXI_22_ARESET_N] [get_bd_pins hbm_0/AXI_21_ARESET_N] \
  [get_bd_pins hbm_0/AXI_20_ARESET_N] [get_bd_pins hbm_0/AXI_19_ARESET_N] [get_bd_pins hbm_0/AXI_18_ARESET_N] \
  [get_bd_pins hbm_0/AXI_17_ARESET_N] [get_bd_pins hbm_0/AXI_16_ARESET_N] [get_bd_pins TG_0/axi_aresetn] \
  [get_bd_pins TG_10/axi_aresetn] [get_bd_pins TG_11/axi_aresetn] [get_bd_pins TG_12/axi_aresetn] \
  [get_bd_pins TG_13/axi_aresetn] [get_bd_pins TG_14/axi_aresetn] [get_bd_pins TG_15/axi_aresetn] \
  [get_bd_pins TG_16/axi_aresetn] [get_bd_pins TG_17/axi_aresetn] [get_bd_pins TG_18/axi_aresetn] \
  [get_bd_pins TG_19/axi_aresetn] [get_bd_pins TG_1/axi_aresetn] [get_bd_pins TG_20/axi_aresetn] \
  [get_bd_pins TG_21/axi_aresetn] [get_bd_pins TG_22/axi_aresetn] [get_bd_pins TG_23/axi_aresetn] \
  [get_bd_pins TG_24/axi_aresetn] [get_bd_pins TG_25/axi_aresetn] [get_bd_pins TG_26/axi_aresetn] \
  [get_bd_pins TG_27/axi_aresetn] [get_bd_pins TG_28/axi_aresetn] [get_bd_pins TG_29/axi_aresetn] \
  [get_bd_pins TG_2/axi_aresetn] [get_bd_pins TG_30/axi_aresetn] [get_bd_pins TG_31/axi_aresetn] \
  [get_bd_pins TG_3/axi_aresetn] [get_bd_pins TG_4/axi_aresetn] [get_bd_pins TG_5/axi_aresetn] [get_bd_pins TG_6/axi_aresetn] \
  [get_bd_pins TG_7/axi_aresetn] [get_bd_pins TG_8/axi_aresetn] [get_bd_pins TG_9/axi_aresetn]
connect_bd_net [get_bd_ports resetn] [get_bd_pins proc_sys_reset_0/ext_reset_in] [get_bd_pins proc_sys_reset_1/ext_reset_in]
connect_bd_net -net xlconstant_0_dout [get_bd_pins TX_RX_0/start] \
  [get_bd_pins TG_0/csr_start] [get_bd_pins TG_10/csr_start] [get_bd_pins TG_11/csr_start] [get_bd_pins TG_12/csr_start] \
  [get_bd_pins TG_13/csr_start] [get_bd_pins TG_14/csr_start] [get_bd_pins TG_15/csr_start] [get_bd_pins TG_16/csr_start] \
  [get_bd_pins TG_17/csr_start] [get_bd_pins TG_18/csr_start] [get_bd_pins TG_19/csr_start] [get_bd_pins TG_1/csr_start] \
  [get_bd_pins TG_20/csr_start] [get_bd_pins TG_21/csr_start] [get_bd_pins TG_22/csr_start] [get_bd_pins TG_23/csr_start] \
  [get_bd_pins TG_24/csr_start] [get_bd_pins TG_25/csr_start] [get_bd_pins TG_26/csr_start] [get_bd_pins TG_27/csr_start] \
  [get_bd_pins TG_28/csr_start] [get_bd_pins TG_29/csr_start] [get_bd_pins TG_2/csr_start] [get_bd_pins TG_30/csr_start] \
  [get_bd_pins TG_31/csr_start] [get_bd_pins TG_3/csr_start] [get_bd_pins TG_4/csr_start] [get_bd_pins TG_5/csr_start] \
  [get_bd_pins TG_6/csr_start] [get_bd_pins TG_7/csr_start] [get_bd_pins TG_8/csr_start] [get_bd_pins TG_9/csr_start] \
  [get_bd_ports start]
connect_bd_net -net xlconstant_0_dout1 [get_bd_pins HIGH/dout] \
  [get_bd_pins AXI_LITE_MASTER_0/read_or_write] [get_bd_pins clk_wiz_0/s_axi_aresetn] \
  [get_bd_pins AXI_LITE_MASTER_0/axi_aresetn]

# ---- address map ----
assign_bd_address -offset 0x000000000 -range 2K -target_address_space [get_bd_addr_spaces AXI_LITE_MASTER_0/axi] [get_bd_addr_segs clk_wiz_0/s_axi_lite/Reg]
assign_bd_address -offset 0x000000000 -range 256M -target_address_space [get_bd_addr_spaces TG_0/axi] [get_bd_addr_segs hbm_0/SAXI_00/HBM_MEM00]
assign_bd_address -offset 0x010000000 -range 256M -target_address_space [get_bd_addr_spaces TG_0/axi] [get_bd_addr_segs hbm_0/SAXI_00/HBM_MEM01]
assign_bd_address -offset 0x020000000 -range 256M -target_address_space [get_bd_addr_spaces TG_0/axi] [get_bd_addr_segs hbm_0/SAXI_00/HBM_MEM02]
assign_bd_address -offset 0x030000000 -range 256M -target_address_space [get_bd_addr_spaces TG_0/axi] [get_bd_addr_segs hbm_0/SAXI_00/HBM_MEM03]
assign_bd_address -offset 0x040000000 -range 256M -target_address_space [get_bd_addr_spaces TG_0/axi] [get_bd_addr_segs hbm_0/SAXI_00/HBM_MEM04]
assign_bd_address -offset 0x050000000 -range 256M -target_address_space [get_bd_addr_spaces TG_0/axi] [get_bd_addr_segs hbm_0/SAXI_00/HBM_MEM05]
assign_bd_address -offset 0x060000000 -range 256M -target_address_space [get_bd_addr_spaces TG_0/axi] [get_bd_addr_segs hbm_0/SAXI_00/HBM_MEM06]
assign_bd_address -offset 0x070000000 -range 256M -target_address_space [get_bd_addr_spaces TG_0/axi] [get_bd_addr_segs hbm_0/SAXI_00/HBM_MEM07]
assign_bd_address -offset 0x080000000 -range 256M -target_address_space [get_bd_addr_spaces TG_0/axi] [get_bd_addr_segs hbm_0/SAXI_00/HBM_MEM08]
assign_bd_address -offset 0x090000000 -range 256M -target_address_space [get_bd_addr_spaces TG_0/axi] [get_bd_addr_segs hbm_0/SAXI_00/HBM_MEM09]
assign_bd_address -offset 0x0A0000000 -range 256M -target_address_space [get_bd_addr_spaces TG_0/axi] [get_bd_addr_segs hbm_0/SAXI_00/HBM_MEM10]
assign_bd_address -offset 0x0B0000000 -range 256M -target_address_space [get_bd_addr_spaces TG_0/axi] [get_bd_addr_segs hbm_0/SAXI_00/HBM_MEM11]
assign_bd_address -offset 0x0C0000000 -range 256M -target_address_space [get_bd_addr_spaces TG_0/axi] [get_bd_addr_segs hbm_0/SAXI_00/HBM_MEM12]
assign_bd_address -offset 0x0D0000000 -range 256M -target_address_space [get_bd_addr_spaces TG_0/axi] [get_bd_addr_segs hbm_0/SAXI_00/HBM_MEM13]
assign_bd_address -offset 0x0E0000000 -range 256M -target_address_space [get_bd_addr_spaces TG_0/axi] [get_bd_addr_segs hbm_0/SAXI_00/HBM_MEM14]
assign_bd_address -offset 0x0F0000000 -range 256M -target_address_space [get_bd_addr_spaces TG_0/axi] [get_bd_addr_segs hbm_0/SAXI_00/HBM_MEM15]
assign_bd_address -offset 0x100000000 -range 256M -target_address_space [get_bd_addr_spaces TG_0/axi] [get_bd_addr_segs hbm_0/SAXI_00/HBM_MEM16]
assign_bd_address -offset 0x110000000 -range 256M -target_address_space [get_bd_addr_spaces TG_0/axi] [get_bd_addr_segs hbm_0/SAXI_00/HBM_MEM17]
assign_bd_address -offset 0x120000000 -range 256M -target_address_space [get_bd_addr_spaces TG_0/axi] [get_bd_addr_segs hbm_0/SAXI_00/HBM_MEM18]
assign_bd_address -offset 0x130000000 -range 256M -target_address_space [get_bd_addr_spaces TG_0/axi] [get_bd_addr_segs hbm_0/SAXI_00/HBM_MEM19]
assign_bd_address -offset 0x140000000 -range 256M -target_address_space [get_bd_addr_spaces TG_0/axi] [get_bd_addr_segs hbm_0/SAXI_00/HBM_MEM20]
assign_bd_address -offset 0x150000000 -range 256M -target_address_space [get_bd_addr_spaces TG_0/axi] [get_bd_addr_segs hbm_0/SAXI_00/HBM_MEM21]
assign_bd_address -offset 0x160000000 -range 256M -target_address_space [get_bd_addr_spaces TG_0/axi] [get_bd_addr_segs hbm_0/SAXI_00/HBM_MEM22]
assign_bd_address -offset 0x170000000 -range 256M -target_address_space [get_bd_addr_spaces TG_0/axi] [get_bd_addr_segs hbm_0/SAXI_00/HBM_MEM23]
assign_bd_address -offset 0x180000000 -range 256M -target_address_space [get_bd_addr_spaces TG_0/axi] [get_bd_addr_segs hbm_0/SAXI_00/HBM_MEM24]
assign_bd_address -offset 0x190000000 -range 256M -target_address_space [get_bd_addr_spaces TG_0/axi] [get_bd_addr_segs hbm_0/SAXI_00/HBM_MEM25]
assign_bd_address -offset 0x1A0000000 -range 256M -target_address_space [get_bd_addr_spaces TG_0/axi] [get_bd_addr_segs hbm_0/SAXI_00/HBM_MEM26]
assign_bd_address -offset 0x1B0000000 -range 256M -target_address_space [get_bd_addr_spaces TG_0/axi] [get_bd_addr_segs hbm_0/SAXI_00/HBM_MEM27]
assign_bd_address -offset 0x1C0000000 -range 256M -target_address_space [get_bd_addr_spaces TG_0/axi] [get_bd_addr_segs hbm_0/SAXI_00/HBM_MEM28]
assign_bd_address -offset 0x1D0000000 -range 256M -target_address_space [get_bd_addr_spaces TG_0/axi] [get_bd_addr_segs hbm_0/SAXI_00/HBM_MEM29]
assign_bd_address -offset 0x1E0000000 -range 256M -target_address_space [get_bd_addr_spaces TG_0/axi] [get_bd_addr_segs hbm_0/SAXI_00/HBM_MEM30]
assign_bd_address -offset 0x1F0000000 -range 256M -target_address_space [get_bd_addr_spaces TG_0/axi] [get_bd_addr_segs hbm_0/SAXI_00/HBM_MEM31]
assign_bd_address -offset 0x000000000 -range 256M -target_address_space [get_bd_addr_spaces TG_1/axi] [get_bd_addr_segs hbm_0/SAXI_01/HBM_MEM00]
assign_bd_address -offset 0x010000000 -range 256M -target_address_space [get_bd_addr_spaces TG_1/axi] [get_bd_addr_segs hbm_0/SAXI_01/HBM_MEM01]
assign_bd_address -offset 0x020000000 -range 256M -target_address_space [get_bd_addr_spaces TG_1/axi] [get_bd_addr_segs hbm_0/SAXI_01/HBM_MEM02]
assign_bd_address -offset 0x030000000 -range 256M -target_address_space [get_bd_addr_spaces TG_1/axi] [get_bd_addr_segs hbm_0/SAXI_01/HBM_MEM03]
assign_bd_address -offset 0x040000000 -range 256M -target_address_space [get_bd_addr_spaces TG_1/axi] [get_bd_addr_segs hbm_0/SAXI_01/HBM_MEM04]
assign_bd_address -offset 0x050000000 -range 256M -target_address_space [get_bd_addr_spaces TG_1/axi] [get_bd_addr_segs hbm_0/SAXI_01/HBM_MEM05]
assign_bd_address -offset 0x060000000 -range 256M -target_address_space [get_bd_addr_spaces TG_1/axi] [get_bd_addr_segs hbm_0/SAXI_01/HBM_MEM06]
assign_bd_address -offset 0x070000000 -range 256M -target_address_space [get_bd_addr_spaces TG_1/axi] [get_bd_addr_segs hbm_0/SAXI_01/HBM_MEM07]
assign_bd_address -offset 0x080000000 -range 256M -target_address_space [get_bd_addr_spaces TG_1/axi] [get_bd_addr_segs hbm_0/SAXI_01/HBM_MEM08]
assign_bd_address -offset 0x090000000 -range 256M -target_address_space [get_bd_addr_spaces TG_1/axi] [get_bd_addr_segs hbm_0/SAXI_01/HBM_MEM09]
assign_bd_address -offset 0x0A0000000 -range 256M -target_address_space [get_bd_addr_spaces TG_1/axi] [get_bd_addr_segs hbm_0/SAXI_01/HBM_MEM10]
assign_bd_address -offset 0x0B0000000 -range 256M -target_address_space [get_bd_addr_spaces TG_1/axi] [get_bd_addr_segs hbm_0/SAXI_01/HBM_MEM11]
assign_bd_address -offset 0x0C0000000 -range 256M -target_address_space [get_bd_addr_spaces TG_1/axi] [get_bd_addr_segs hbm_0/SAXI_01/HBM_MEM12]
assign_bd_address -offset 0x0D0000000 -range 256M -target_address_space [get_bd_addr_spaces TG_1/axi] [get_bd_addr_segs hbm_0/SAXI_01/HBM_MEM13]
assign_bd_address -offset 0x0E0000000 -range 256M -target_address_space [get_bd_addr_spaces TG_1/axi] [get_bd_addr_segs hbm_0/SAXI_01/HBM_MEM14]
assign_bd_address -offset 0x0F0000000 -range 256M -target_address_space [get_bd_addr_spaces TG_1/axi] [get_bd_addr_segs hbm_0/SAXI_01/HBM_MEM15]
assign_bd_address -offset 0x100000000 -range 256M -target_address_space [get_bd_addr_spaces TG_1/axi] [get_bd_addr_segs hbm_0/SAXI_01/HBM_MEM16]
assign_bd_address -offset 0x110000000 -range 256M -target_address_space [get_bd_addr_spaces TG_1/axi] [get_bd_addr_segs hbm_0/SAXI_01/HBM_MEM17]
assign_bd_address -offset 0x120000000 -range 256M -target_address_space [get_bd_addr_spaces TG_1/axi] [get_bd_addr_segs hbm_0/SAXI_01/HBM_MEM18]
assign_bd_address -offset 0x130000000 -range 256M -target_address_space [get_bd_addr_spaces TG_1/axi] [get_bd_addr_segs hbm_0/SAXI_01/HBM_MEM19]
assign_bd_address -offset 0x140000000 -range 256M -target_address_space [get_bd_addr_spaces TG_1/axi] [get_bd_addr_segs hbm_0/SAXI_01/HBM_MEM20]
assign_bd_address -offset 0x150000000 -range 256M -target_address_space [get_bd_addr_spaces TG_1/axi] [get_bd_addr_segs hbm_0/SAXI_01/HBM_MEM21]
assign_bd_address -offset 0x160000000 -range 256M -target_address_space [get_bd_addr_spaces TG_1/axi] [get_bd_addr_segs hbm_0/SAXI_01/HBM_MEM22]
assign_bd_address -offset 0x170000000 -range 256M -target_address_space [get_bd_addr_spaces TG_1/axi] [get_bd_addr_segs hbm_0/SAXI_01/HBM_MEM23]
assign_bd_address -offset 0x180000000 -range 256M -target_address_space [get_bd_addr_spaces TG_1/axi] [get_bd_addr_segs hbm_0/SAXI_01/HBM_MEM24]
assign_bd_address -offset 0x190000000 -range 256M -target_address_space [get_bd_addr_spaces TG_1/axi] [get_bd_addr_segs hbm_0/SAXI_01/HBM_MEM25]
assign_bd_address -offset 0x1A0000000 -range 256M -target_address_space [get_bd_addr_spaces TG_1/axi] [get_bd_addr_segs hbm_0/SAXI_01/HBM_MEM26]
assign_bd_address -offset 0x1B0000000 -range 256M -target_address_space [get_bd_addr_spaces TG_1/axi] [get_bd_addr_segs hbm_0/SAXI_01/HBM_MEM27]
assign_bd_address -offset 0x1C0000000 -range 256M -target_address_space [get_bd_addr_spaces TG_1/axi] [get_bd_addr_segs hbm_0/SAXI_01/HBM_MEM28]
assign_bd_address -offset 0x1D0000000 -range 256M -target_address_space [get_bd_addr_spaces TG_1/axi] [get_bd_addr_segs hbm_0/SAXI_01/HBM_MEM29]
assign_bd_address -offset 0x1E0000000 -range 256M -target_address_space [get_bd_addr_spaces TG_1/axi] [get_bd_addr_segs hbm_0/SAXI_01/HBM_MEM30]
assign_bd_address -offset 0x1F0000000 -range 256M -target_address_space [get_bd_addr_spaces TG_1/axi] [get_bd_addr_segs hbm_0/SAXI_01/HBM_MEM31]
assign_bd_address -offset 0x000000000 -range 256M -target_address_space [get_bd_addr_spaces TG_2/axi] [get_bd_addr_segs hbm_0/SAXI_02/HBM_MEM00]
assign_bd_address -offset 0x010000000 -range 256M -target_address_space [get_bd_addr_spaces TG_2/axi] [get_bd_addr_segs hbm_0/SAXI_02/HBM_MEM01]
assign_bd_address -offset 0x020000000 -range 256M -target_address_space [get_bd_addr_spaces TG_2/axi] [get_bd_addr_segs hbm_0/SAXI_02/HBM_MEM02]
assign_bd_address -offset 0x030000000 -range 256M -target_address_space [get_bd_addr_spaces TG_2/axi] [get_bd_addr_segs hbm_0/SAXI_02/HBM_MEM03]
assign_bd_address -offset 0x040000000 -range 256M -target_address_space [get_bd_addr_spaces TG_2/axi] [get_bd_addr_segs hbm_0/SAXI_02/HBM_MEM04]
assign_bd_address -offset 0x050000000 -range 256M -target_address_space [get_bd_addr_spaces TG_2/axi] [get_bd_addr_segs hbm_0/SAXI_02/HBM_MEM05]
assign_bd_address -offset 0x060000000 -range 256M -target_address_space [get_bd_addr_spaces TG_2/axi] [get_bd_addr_segs hbm_0/SAXI_02/HBM_MEM06]
assign_bd_address -offset 0x070000000 -range 256M -target_address_space [get_bd_addr_spaces TG_2/axi] [get_bd_addr_segs hbm_0/SAXI_02/HBM_MEM07]
assign_bd_address -offset 0x080000000 -range 256M -target_address_space [get_bd_addr_spaces TG_2/axi] [get_bd_addr_segs hbm_0/SAXI_02/HBM_MEM08]
assign_bd_address -offset 0x090000000 -range 256M -target_address_space [get_bd_addr_spaces TG_2/axi] [get_bd_addr_segs hbm_0/SAXI_02/HBM_MEM09]
assign_bd_address -offset 0x0A0000000 -range 256M -target_address_space [get_bd_addr_spaces TG_2/axi] [get_bd_addr_segs hbm_0/SAXI_02/HBM_MEM10]
assign_bd_address -offset 0x0B0000000 -range 256M -target_address_space [get_bd_addr_spaces TG_2/axi] [get_bd_addr_segs hbm_0/SAXI_02/HBM_MEM11]
assign_bd_address -offset 0x0C0000000 -range 256M -target_address_space [get_bd_addr_spaces TG_2/axi] [get_bd_addr_segs hbm_0/SAXI_02/HBM_MEM12]
assign_bd_address -offset 0x0D0000000 -range 256M -target_address_space [get_bd_addr_spaces TG_2/axi] [get_bd_addr_segs hbm_0/SAXI_02/HBM_MEM13]
assign_bd_address -offset 0x0E0000000 -range 256M -target_address_space [get_bd_addr_spaces TG_2/axi] [get_bd_addr_segs hbm_0/SAXI_02/HBM_MEM14]
assign_bd_address -offset 0x0F0000000 -range 256M -target_address_space [get_bd_addr_spaces TG_2/axi] [get_bd_addr_segs hbm_0/SAXI_02/HBM_MEM15]
assign_bd_address -offset 0x100000000 -range 256M -target_address_space [get_bd_addr_spaces TG_2/axi] [get_bd_addr_segs hbm_0/SAXI_02/HBM_MEM16]
assign_bd_address -offset 0x110000000 -range 256M -target_address_space [get_bd_addr_spaces TG_2/axi] [get_bd_addr_segs hbm_0/SAXI_02/HBM_MEM17]
assign_bd_address -offset 0x120000000 -range 256M -target_address_space [get_bd_addr_spaces TG_2/axi] [get_bd_addr_segs hbm_0/SAXI_02/HBM_MEM18]
assign_bd_address -offset 0x130000000 -range 256M -target_address_space [get_bd_addr_spaces TG_2/axi] [get_bd_addr_segs hbm_0/SAXI_02/HBM_MEM19]
assign_bd_address -offset 0x140000000 -range 256M -target_address_space [get_bd_addr_spaces TG_2/axi] [get_bd_addr_segs hbm_0/SAXI_02/HBM_MEM20]
assign_bd_address -offset 0x150000000 -range 256M -target_address_space [get_bd_addr_spaces TG_2/axi] [get_bd_addr_segs hbm_0/SAXI_02/HBM_MEM21]
assign_bd_address -offset 0x160000000 -range 256M -target_address_space [get_bd_addr_spaces TG_2/axi] [get_bd_addr_segs hbm_0/SAXI_02/HBM_MEM22]
assign_bd_address -offset 0x170000000 -range 256M -target_address_space [get_bd_addr_spaces TG_2/axi] [get_bd_addr_segs hbm_0/SAXI_02/HBM_MEM23]
assign_bd_address -offset 0x180000000 -range 256M -target_address_space [get_bd_addr_spaces TG_2/axi] [get_bd_addr_segs hbm_0/SAXI_02/HBM_MEM24]
assign_bd_address -offset 0x190000000 -range 256M -target_address_space [get_bd_addr_spaces TG_2/axi] [get_bd_addr_segs hbm_0/SAXI_02/HBM_MEM25]
assign_bd_address -offset 0x1A0000000 -range 256M -target_address_space [get_bd_addr_spaces TG_2/axi] [get_bd_addr_segs hbm_0/SAXI_02/HBM_MEM26]
assign_bd_address -offset 0x1B0000000 -range 256M -target_address_space [get_bd_addr_spaces TG_2/axi] [get_bd_addr_segs hbm_0/SAXI_02/HBM_MEM27]
assign_bd_address -offset 0x1C0000000 -range 256M -target_address_space [get_bd_addr_spaces TG_2/axi] [get_bd_addr_segs hbm_0/SAXI_02/HBM_MEM28]
assign_bd_address -offset 0x1D0000000 -range 256M -target_address_space [get_bd_addr_spaces TG_2/axi] [get_bd_addr_segs hbm_0/SAXI_02/HBM_MEM29]
assign_bd_address -offset 0x1E0000000 -range 256M -target_address_space [get_bd_addr_spaces TG_2/axi] [get_bd_addr_segs hbm_0/SAXI_02/HBM_MEM30]
assign_bd_address -offset 0x1F0000000 -range 256M -target_address_space [get_bd_addr_spaces TG_2/axi] [get_bd_addr_segs hbm_0/SAXI_02/HBM_MEM31]
assign_bd_address -offset 0x000000000 -range 256M -target_address_space [get_bd_addr_spaces TG_3/axi] [get_bd_addr_segs hbm_0/SAXI_03/HBM_MEM00]
assign_bd_address -offset 0x010000000 -range 256M -target_address_space [get_bd_addr_spaces TG_3/axi] [get_bd_addr_segs hbm_0/SAXI_03/HBM_MEM01]
assign_bd_address -offset 0x020000000 -range 256M -target_address_space [get_bd_addr_spaces TG_3/axi] [get_bd_addr_segs hbm_0/SAXI_03/HBM_MEM02]
assign_bd_address -offset 0x030000000 -range 256M -target_address_space [get_bd_addr_spaces TG_3/axi] [get_bd_addr_segs hbm_0/SAXI_03/HBM_MEM03]
assign_bd_address -offset 0x040000000 -range 256M -target_address_space [get_bd_addr_spaces TG_3/axi] [get_bd_addr_segs hbm_0/SAXI_03/HBM_MEM04]
assign_bd_address -offset 0x050000000 -range 256M -target_address_space [get_bd_addr_spaces TG_3/axi] [get_bd_addr_segs hbm_0/SAXI_03/HBM_MEM05]
assign_bd_address -offset 0x060000000 -range 256M -target_address_space [get_bd_addr_spaces TG_3/axi] [get_bd_addr_segs hbm_0/SAXI_03/HBM_MEM06]
assign_bd_address -offset 0x070000000 -range 256M -target_address_space [get_bd_addr_spaces TG_3/axi] [get_bd_addr_segs hbm_0/SAXI_03/HBM_MEM07]
assign_bd_address -offset 0x080000000 -range 256M -target_address_space [get_bd_addr_spaces TG_3/axi] [get_bd_addr_segs hbm_0/SAXI_03/HBM_MEM08]
assign_bd_address -offset 0x090000000 -range 256M -target_address_space [get_bd_addr_spaces TG_3/axi] [get_bd_addr_segs hbm_0/SAXI_03/HBM_MEM09]
assign_bd_address -offset 0x0A0000000 -range 256M -target_address_space [get_bd_addr_spaces TG_3/axi] [get_bd_addr_segs hbm_0/SAXI_03/HBM_MEM10]
assign_bd_address -offset 0x0B0000000 -range 256M -target_address_space [get_bd_addr_spaces TG_3/axi] [get_bd_addr_segs hbm_0/SAXI_03/HBM_MEM11]
assign_bd_address -offset 0x0C0000000 -range 256M -target_address_space [get_bd_addr_spaces TG_3/axi] [get_bd_addr_segs hbm_0/SAXI_03/HBM_MEM12]
assign_bd_address -offset 0x0D0000000 -range 256M -target_address_space [get_bd_addr_spaces TG_3/axi] [get_bd_addr_segs hbm_0/SAXI_03/HBM_MEM13]
assign_bd_address -offset 0x0E0000000 -range 256M -target_address_space [get_bd_addr_spaces TG_3/axi] [get_bd_addr_segs hbm_0/SAXI_03/HBM_MEM14]
assign_bd_address -offset 0x0F0000000 -range 256M -target_address_space [get_bd_addr_spaces TG_3/axi] [get_bd_addr_segs hbm_0/SAXI_03/HBM_MEM15]
assign_bd_address -offset 0x100000000 -range 256M -target_address_space [get_bd_addr_spaces TG_3/axi] [get_bd_addr_segs hbm_0/SAXI_03/HBM_MEM16]
assign_bd_address -offset 0x110000000 -range 256M -target_address_space [get_bd_addr_spaces TG_3/axi] [get_bd_addr_segs hbm_0/SAXI_03/HBM_MEM17]
assign_bd_address -offset 0x120000000 -range 256M -target_address_space [get_bd_addr_spaces TG_3/axi] [get_bd_addr_segs hbm_0/SAXI_03/HBM_MEM18]
assign_bd_address -offset 0x130000000 -range 256M -target_address_space [get_bd_addr_spaces TG_3/axi] [get_bd_addr_segs hbm_0/SAXI_03/HBM_MEM19]
assign_bd_address -offset 0x140000000 -range 256M -target_address_space [get_bd_addr_spaces TG_3/axi] [get_bd_addr_segs hbm_0/SAXI_03/HBM_MEM20]
assign_bd_address -offset 0x150000000 -range 256M -target_address_space [get_bd_addr_spaces TG_3/axi] [get_bd_addr_segs hbm_0/SAXI_03/HBM_MEM21]
assign_bd_address -offset 0x160000000 -range 256M -target_address_space [get_bd_addr_spaces TG_3/axi] [get_bd_addr_segs hbm_0/SAXI_03/HBM_MEM22]
assign_bd_address -offset 0x170000000 -range 256M -target_address_space [get_bd_addr_spaces TG_3/axi] [get_bd_addr_segs hbm_0/SAXI_03/HBM_MEM23]
assign_bd_address -offset 0x180000000 -range 256M -target_address_space [get_bd_addr_spaces TG_3/axi] [get_bd_addr_segs hbm_0/SAXI_03/HBM_MEM24]
assign_bd_address -offset 0x190000000 -range 256M -target_address_space [get_bd_addr_spaces TG_3/axi] [get_bd_addr_segs hbm_0/SAXI_03/HBM_MEM25]
assign_bd_address -offset 0x1A0000000 -range 256M -target_address_space [get_bd_addr_spaces TG_3/axi] [get_bd_addr_segs hbm_0/SAXI_03/HBM_MEM26]
assign_bd_address -offset 0x1B0000000 -range 256M -target_address_space [get_bd_addr_spaces TG_3/axi] [get_bd_addr_segs hbm_0/SAXI_03/HBM_MEM27]
assign_bd_address -offset 0x1C0000000 -range 256M -target_address_space [get_bd_addr_spaces TG_3/axi] [get_bd_addr_segs hbm_0/SAXI_03/HBM_MEM28]
assign_bd_address -offset 0x1D0000000 -range 256M -target_address_space [get_bd_addr_spaces TG_3/axi] [get_bd_addr_segs hbm_0/SAXI_03/HBM_MEM29]
assign_bd_address -offset 0x1E0000000 -range 256M -target_address_space [get_bd_addr_spaces TG_3/axi] [get_bd_addr_segs hbm_0/SAXI_03/HBM_MEM30]
assign_bd_address -offset 0x1F0000000 -range 256M -target_address_space [get_bd_addr_spaces TG_3/axi] [get_bd_addr_segs hbm_0/SAXI_03/HBM_MEM31]
assign_bd_address -offset 0x000000000 -range 256M -target_address_space [get_bd_addr_spaces TG_4/axi] [get_bd_addr_segs hbm_0/SAXI_04/HBM_MEM00]
assign_bd_address -offset 0x010000000 -range 256M -target_address_space [get_bd_addr_spaces TG_4/axi] [get_bd_addr_segs hbm_0/SAXI_04/HBM_MEM01]
assign_bd_address -offset 0x020000000 -range 256M -target_address_space [get_bd_addr_spaces TG_4/axi] [get_bd_addr_segs hbm_0/SAXI_04/HBM_MEM02]
assign_bd_address -offset 0x030000000 -range 256M -target_address_space [get_bd_addr_spaces TG_4/axi] [get_bd_addr_segs hbm_0/SAXI_04/HBM_MEM03]
assign_bd_address -offset 0x040000000 -range 256M -target_address_space [get_bd_addr_spaces TG_4/axi] [get_bd_addr_segs hbm_0/SAXI_04/HBM_MEM04]
assign_bd_address -offset 0x050000000 -range 256M -target_address_space [get_bd_addr_spaces TG_4/axi] [get_bd_addr_segs hbm_0/SAXI_04/HBM_MEM05]
assign_bd_address -offset 0x060000000 -range 256M -target_address_space [get_bd_addr_spaces TG_4/axi] [get_bd_addr_segs hbm_0/SAXI_04/HBM_MEM06]
assign_bd_address -offset 0x070000000 -range 256M -target_address_space [get_bd_addr_spaces TG_4/axi] [get_bd_addr_segs hbm_0/SAXI_04/HBM_MEM07]
assign_bd_address -offset 0x080000000 -range 256M -target_address_space [get_bd_addr_spaces TG_4/axi] [get_bd_addr_segs hbm_0/SAXI_04/HBM_MEM08]
assign_bd_address -offset 0x090000000 -range 256M -target_address_space [get_bd_addr_spaces TG_4/axi] [get_bd_addr_segs hbm_0/SAXI_04/HBM_MEM09]
assign_bd_address -offset 0x0A0000000 -range 256M -target_address_space [get_bd_addr_spaces TG_4/axi] [get_bd_addr_segs hbm_0/SAXI_04/HBM_MEM10]
assign_bd_address -offset 0x0B0000000 -range 256M -target_address_space [get_bd_addr_spaces TG_4/axi] [get_bd_addr_segs hbm_0/SAXI_04/HBM_MEM11]
assign_bd_address -offset 0x0C0000000 -range 256M -target_address_space [get_bd_addr_spaces TG_4/axi] [get_bd_addr_segs hbm_0/SAXI_04/HBM_MEM12]
assign_bd_address -offset 0x0D0000000 -range 256M -target_address_space [get_bd_addr_spaces TG_4/axi] [get_bd_addr_segs hbm_0/SAXI_04/HBM_MEM13]
assign_bd_address -offset 0x0E0000000 -range 256M -target_address_space [get_bd_addr_spaces TG_4/axi] [get_bd_addr_segs hbm_0/SAXI_04/HBM_MEM14]
assign_bd_address -offset 0x0F0000000 -range 256M -target_address_space [get_bd_addr_spaces TG_4/axi] [get_bd_addr_segs hbm_0/SAXI_04/HBM_MEM15]
assign_bd_address -offset 0x100000000 -range 256M -target_address_space [get_bd_addr_spaces TG_4/axi] [get_bd_addr_segs hbm_0/SAXI_04/HBM_MEM16]
assign_bd_address -offset 0x110000000 -range 256M -target_address_space [get_bd_addr_spaces TG_4/axi] [get_bd_addr_segs hbm_0/SAXI_04/HBM_MEM17]
assign_bd_address -offset 0x120000000 -range 256M -target_address_space [get_bd_addr_spaces TG_4/axi] [get_bd_addr_segs hbm_0/SAXI_04/HBM_MEM18]
assign_bd_address -offset 0x130000000 -range 256M -target_address_space [get_bd_addr_spaces TG_4/axi] [get_bd_addr_segs hbm_0/SAXI_04/HBM_MEM19]
assign_bd_address -offset 0x140000000 -range 256M -target_address_space [get_bd_addr_spaces TG_4/axi] [get_bd_addr_segs hbm_0/SAXI_04/HBM_MEM20]
